# EAGLE design X15_Brickstribution (EAGLE 9.6.2)

## Sheet 1 of 2
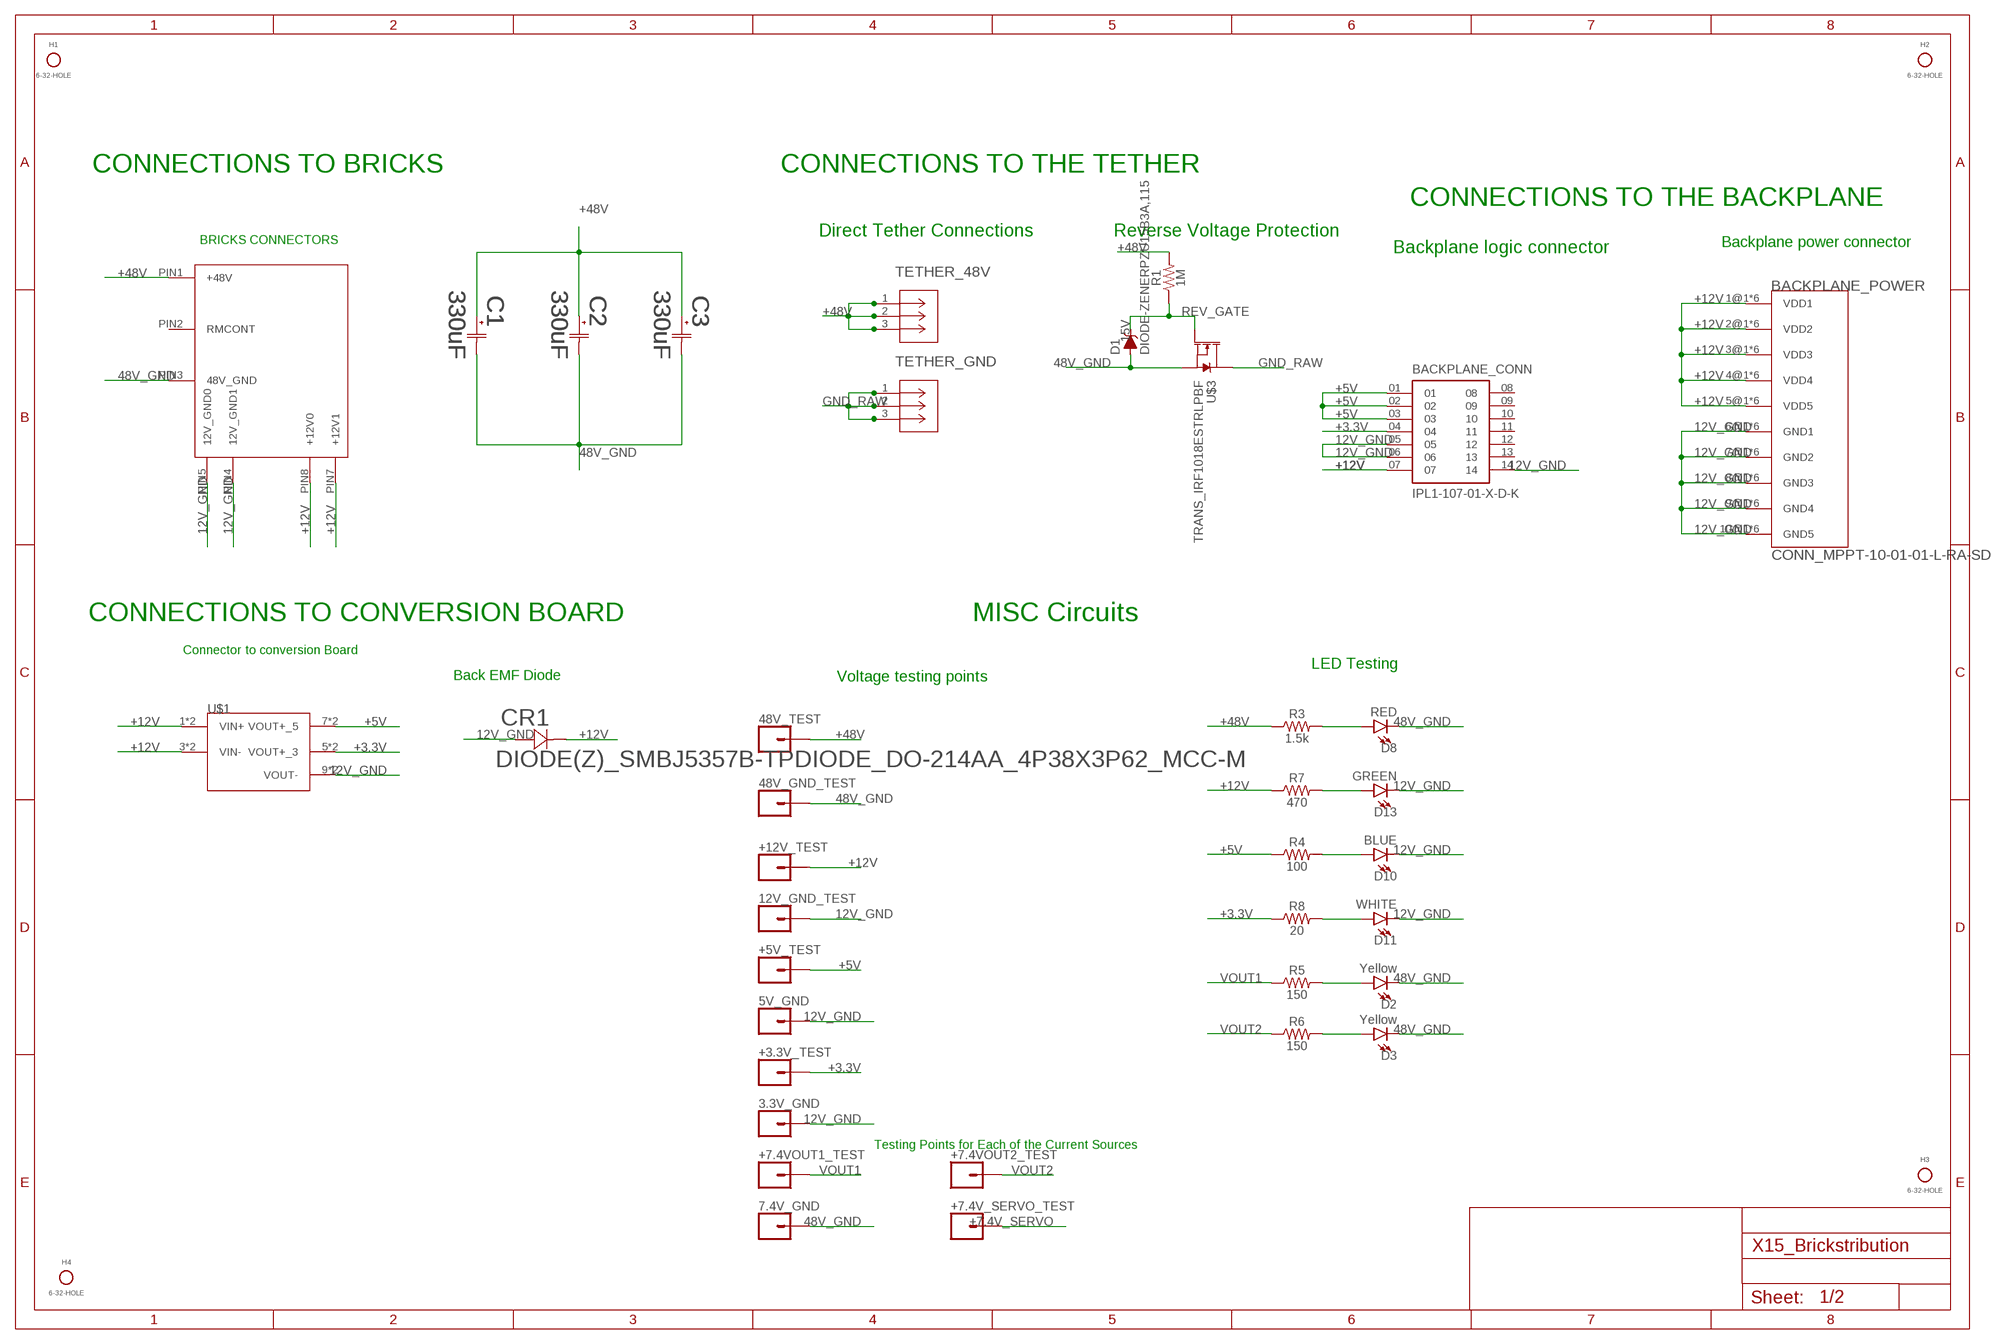
[diagram p0: schematic, sheet 1]

### Parts
3.3V_GND  CONN_01  [1X01]
5V_GND  CONN_01  [1X01]
7.4V_GND  CONN_01  [1X01]
12V_GND_TEST  CONN_01  [1X01]
48V_GND_TEST  CONN_01  [1X01]
48V_TEST  CONN_01  [1X01]
+3.3V_TEST  CONN_01  [1X01]
+5V_TEST  CONN_01  [1X01]
+7.4V_SERVO_TEST  CONN_01  [1X01]
+7.4VOUT1_TEST  CONN_01  [1X01]
+7.4VOUT2_TEST  CONN_01  [1X01]
+12V_TEST  CONN_01  [1X01]
BACKPLANE_CONN  IPL1-107-01-X-D-K  [SAMTEC_IPL1-107-01-X-D-K]
BACKPLANE_POWER  CONN_MPPT-10-01-01-L-RA-SD  [MPPT-10-01-01-L-RA-SD]
C1  330uF  CAP_MAL215099112E3CAP_099112E3_VIS-M  [CAP_099112E3_VIS-M]
C2  330uF  CAP_MAL215099112E3CAP_099112E3_VIS-M  [CAP_099112E3_VIS-M]
C3  330uF  CAP_MAL215099112E3CAP_099112E3_VIS-M  [CAP_099112E3_VIS-M]
CR1  DIODE(Z)_SMBJ5357B-TPDIODE_DO-214AA_4P38X3P62_MCC-M  [DIODE_DO-214AA_4P38X3P62_MCC-M]
D1  DIODE-ZENERPZU15B3A,115  [SOD-323]
D2  Yellow  LED-YELLOW0603  [LED-0603]
D3  Yellow  LED-YELLOW0603  [LED-0603]
D8  RED  LED-RED0603  [LED-0603]
D10  BLUE  LED-BLUE0603  [LED-0603]
D11  WHITE  LED-WHITE0603  [LED-0603]
D13  GREEN  LED-GREEN0603  [LED-0603]
H1  6-32-HOLE  [6-32-HOLE]
H2  6-32-HOLE  [6-32-HOLE]
H3  6-32-HOLE  [6-32-HOLE]
H4  6-32-HOLE  [6-32-HOLE]
R1  1M  1MOHM-0603-1/4W-5%  [0603]
R3  1.5k  1.5KOHM-0603-1/10W-1%  [0603]
R4  100  100OHM-0603-1/4W-5%  [0603]
R5  150  150OHM-0603-1/10W-1%  [0603]
R6  150  150OHM-0603-1/10W-1%  [0603]
R7  470  470OHM-0603-1/10W-1%  [0603]
R8  20  20OHM-0603-1/10W-1%  [0603]
TETHER_48V  796636-3(TETHER)  [CON3_P5MM_VER_TERM-BLK_TYC]
TETHER_GND  796636-3(TETHER)  [CON3_P5MM_VER_TERM-BLK_TYC]
U$1  CONN_DISTRIBUTION_TO_CONVERSION  [TSW-105-05-G-S(D-C)]
U$2  CONN_BMR480_CONNECTOR  [BMR480_CONNECTOR]
U$3  TRANS_IRF1018ESTRLPBF  TRANS_IRF1018EPBF  [D2PAK]

### Nets
12V_GND: 3.3V_GND.1 5V_GND.1 12V_GND_TEST.1 BACKPLANE_CONN.05 BACKPLANE_CONN.06 BACKPLANE_CONN.14 BACKPLANE_POWER.6@1(GND1) BACKPLANE_POWER.6@2(GND1) BACKPLANE_POWER.6@3(GND1) BACKPLANE_POWER.6@4(GND1) BACKPLANE_POWER.6@5(GND1) BACKPLANE_POWER.6@6(GND1) BACKPLANE_POWER.7@1(GND2) BACKPLANE_POWER.7@2(GND2) BACKPLANE_POWER.7@3(GND2) BACKPLANE_POWER.7@4(GND2) BACKPLANE_POWER.7@5(GND2) BACKPLANE_POWER.7@6(GND2) BACKPLANE_POWER.8@1(GND3) BACKPLANE_POWER.8@2(GND3) BACKPLANE_POWER.8@3(GND3) BACKPLANE_POWER.8@4(GND3) BACKPLANE_POWER.8@5(GND3) BACKPLANE_POWER.8@6(GND3) BACKPLANE_POWER.9@1(GND4) BACKPLANE_POWER.9@2(GND4) BACKPLANE_POWER.9@3(GND4) BACKPLANE_POWER.9@4(GND4) BACKPLANE_POWER.9@5(GND4) BACKPLANE_POWER.9@6(GND4) BACKPLANE_POWER.10@1(GND5) BACKPLANE_POWER.10@2(GND5) BACKPLANE_POWER.10@3(GND5) BACKPLANE_POWER.10@4(GND5) BACKPLANE_POWER.10@5(GND5) BACKPLANE_POWER.10@6(GND5) CR1.2 D10.C D11.C D13.C U$1.9(VOUT-) U$1.10(VOUT-) U$2.PIN4(12V_GND1) U$2.PIN5(12V_GND0)
48V_GND: 7.4V_GND.1 48V_GND_TEST.1 C1.2 C2.2 C3.2 D1.A D2.C D3.C D8.C U$2.PIN3(48V_GND) U$3.2(S) ; also sheet 2
+3.3V: +3.3V_TEST.1 BACKPLANE_CONN.04 R8.1 U$1.5(VOUT+_3) U$1.6(VOUT+_3)
+5V: +5V_TEST.1 BACKPLANE_CONN.01 BACKPLANE_CONN.02 BACKPLANE_CONN.03 R4.1 U$1.7(VOUT+_5) U$1.8(VOUT+_5)
+7.4V_SERVO: +7.4V_SERVO_TEST.1 ; also sheet 2
+12V: +12V_TEST.1 BACKPLANE_CONN.07 BACKPLANE_POWER.1@1(VDD1) BACKPLANE_POWER.1@2(VDD1) BACKPLANE_POWER.1@3(VDD1) BACKPLANE_POWER.1@4(VDD1) BACKPLANE_POWER.1@5(VDD1) BACKPLANE_POWER.1@6(VDD1) BACKPLANE_POWER.2@1(VDD2) BACKPLANE_POWER.2@2(VDD2) BACKPLANE_POWER.2@3(VDD2) BACKPLANE_POWER.2@4(VDD2) BACKPLANE_POWER.2@5(VDD2) BACKPLANE_POWER.2@6(VDD2) BACKPLANE_POWER.3@1(VDD3) BACKPLANE_POWER.3@2(VDD3) BACKPLANE_POWER.3@3(VDD3) BACKPLANE_POWER.3@4(VDD3) BACKPLANE_POWER.3@5(VDD3) BACKPLANE_POWER.3@6(VDD3) BACKPLANE_POWER.4@1(VDD4) BACKPLANE_POWER.4@2(VDD4) BACKPLANE_POWER.4@3(VDD4) BACKPLANE_POWER.4@4(VDD4) BACKPLANE_POWER.4@5(VDD4) BACKPLANE_POWER.4@6(VDD4) BACKPLANE_POWER.5@1(VDD5) BACKPLANE_POWER.5@2(VDD5) BACKPLANE_POWER.5@3(VDD5) BACKPLANE_POWER.5@4(VDD5) BACKPLANE_POWER.5@5(VDD5) BACKPLANE_POWER.5@6(VDD5) CR1.1 R7.1 U$1.1(VIN+) U$1.2(VIN+) U$1.3(VIN-) U$1.4(VIN-) U$2.PIN7(+12V1) U$2.PIN8(+12V0)
+48V: 48V_TEST.1 C1.1 C2.1 C3.1 R1.2 R3.1 TETHER_48V.1 TETHER_48V.2 TETHER_48V.3 U$2.PIN1(+48V) ; also sheet 2
GND_RAW: TETHER_GND.1 TETHER_GND.2 TETHER_GND.3 U$3.3(D)
N$4: D8.A R3.2
N$9: D10.A R4.2
N$10: D11.A R8.2
N$11: D3.A R6.2
N$12: D2.A R5.2
N$13: D13.A R7.2
REV_GATE: D1.C R1.1 U$3.1(G)
VOUT1: +7.4VOUT1_TEST.1 R5.1 ; also sheet 2
VOUT2: +7.4VOUT2_TEST.1 R6.1 ; also sheet 2
Unconnected: BACKPLANE_CONN.08 BACKPLANE_CONN.09 BACKPLANE_CONN.10 BACKPLANE_CONN.11 BACKPLANE_CONN.12 BACKPLANE_CONN.13 U$2.PIN2(RMCONT)

### Notes on the sheet
- CONNECTIONS TO BRICKS | CONNECTIONS TO THE TETHER
- CONNECTIONS TO THE BACKPLANE
- Direct Tether Connections | Reverse Voltage Protection
- BRICKS CONNECTORS | Backplane power connector
- Backplane logic connector
- CONNECTIONS TO CONVERSION BOARD | MISC Circuits
- Connector to conversion Board
- LED Testing
- Back EMF Diode | Voltage testing points
- Testing Points for Each of the Current Sources

## Sheet 2 of 2
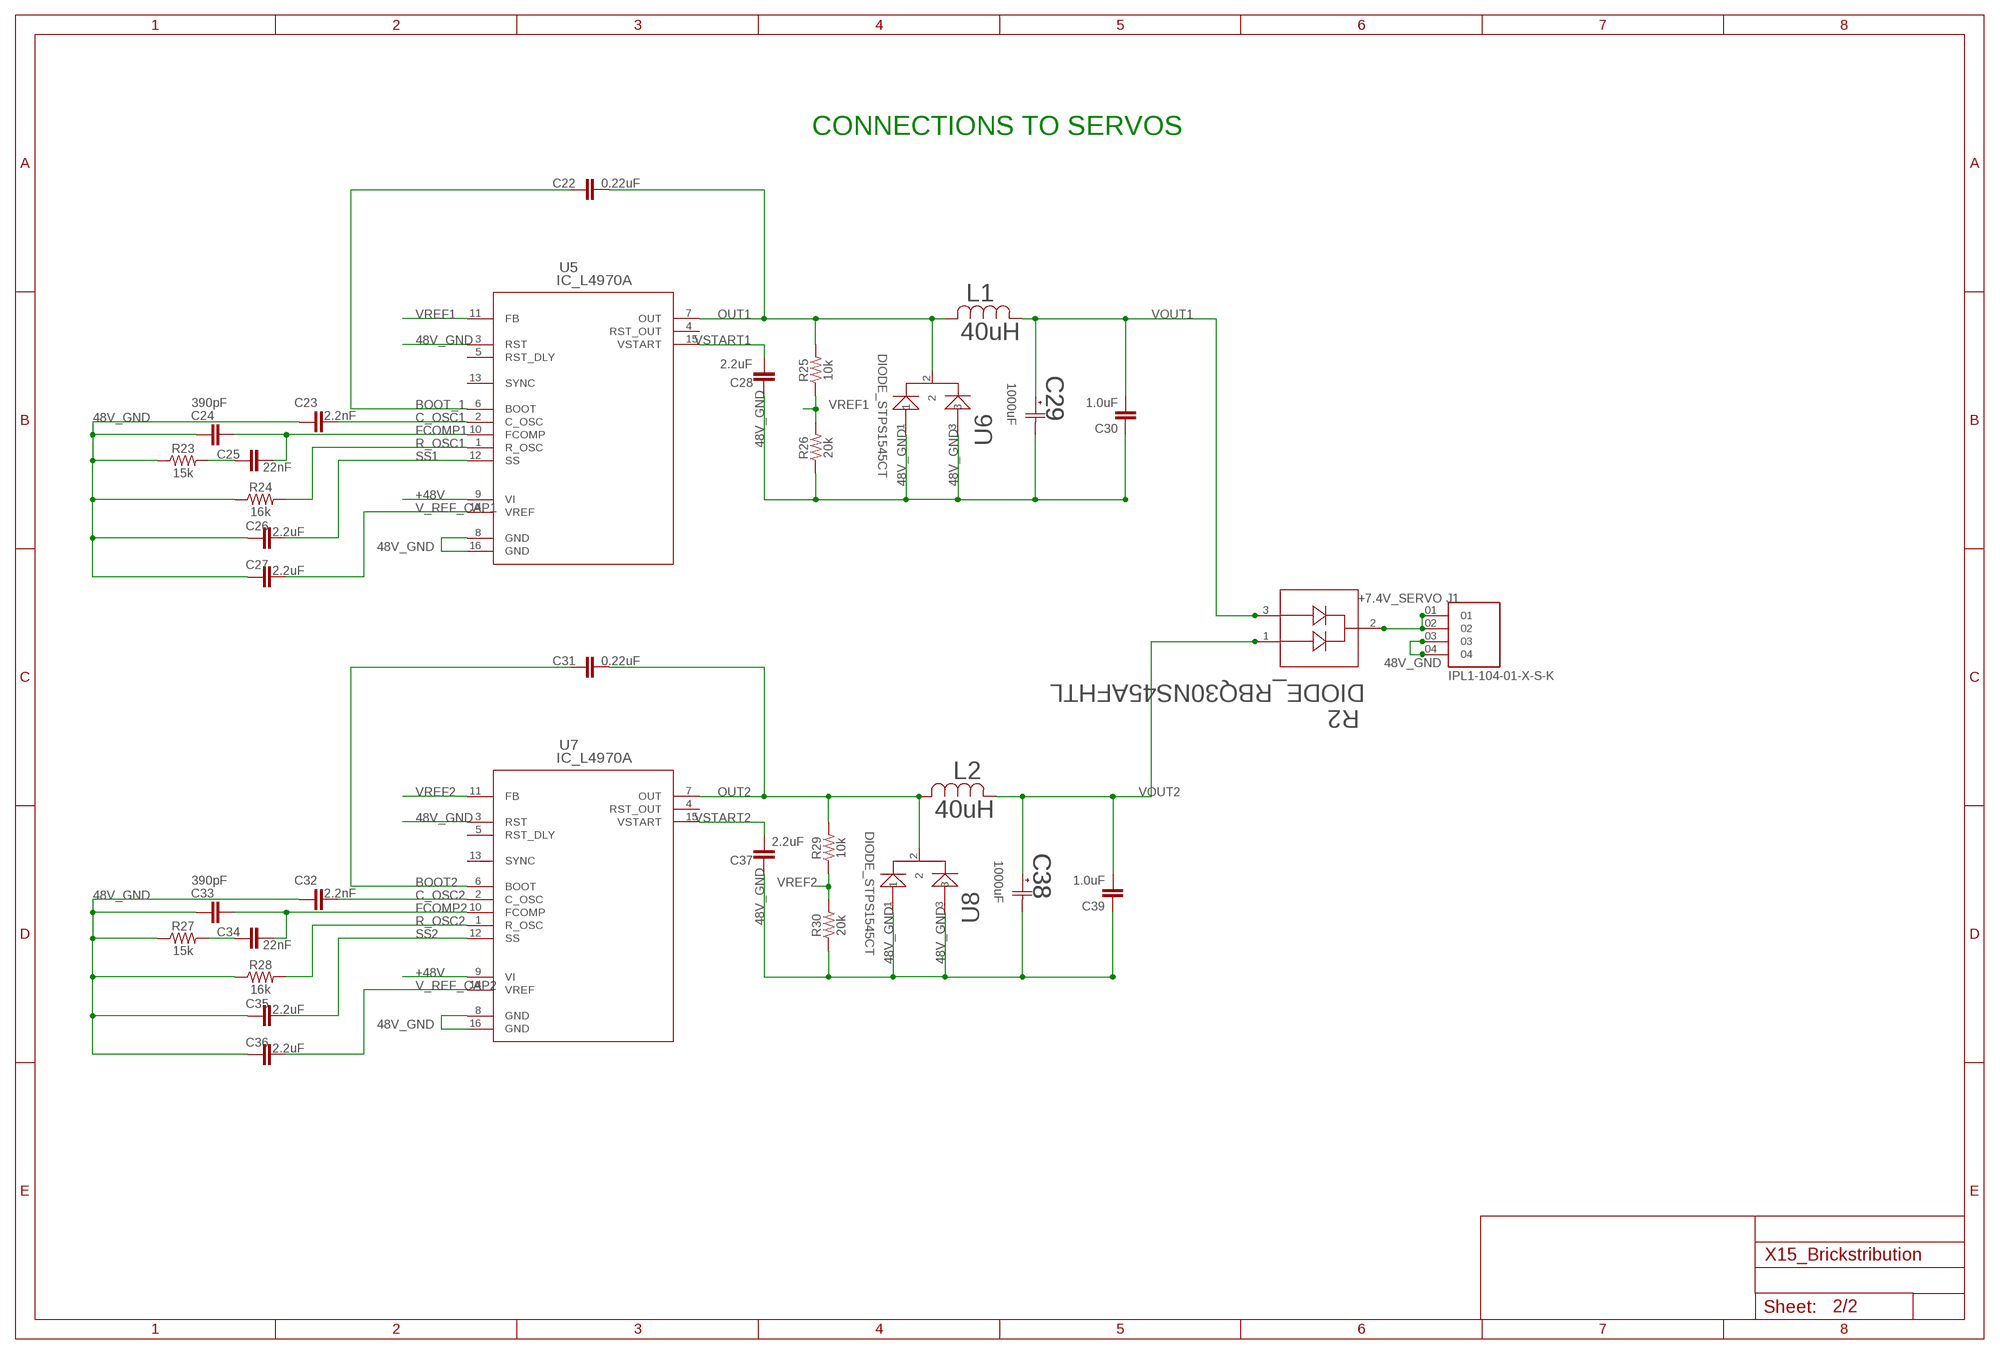
[diagram p1: schematic, sheet 2]

### Parts
C22  0.22uF  0.22UF-0603-25V-10%  [0603]
C23  2.2nF  2.2NF/2200PF-0603-50V-10%  [0603]
C24  390pF  390NF-0603-10V-10%  [0603]
C25  22nF  22NF/22,000PF-0603-50V-10%  [0603]
C26  2.2uF  2.2UF-0603-10V-20%  [0603]
C27  2.2uF  2.2UF-0603-10V-20%  [0603]
C28  2.2uF  2.2UF-0603-10V-20%  [0603]
C29  1000uF  CAP_PCG1A102MCL1GSCAP_PC_10X12P7_NCH-M  [CAP_PC_10X12P7_NCH-M]
C30  1.0uF  1.0UF-0603-16V-10%  [0603]
C31  0.22uF  0.22UF-0603-25V-10%  [0603]
C32  2.2nF  2.2NF/2200PF-0603-50V-10%  [0603]
C33  390pF  390NF-0603-10V-10%  [0603]
C34  22nF  22NF/22,000PF-0603-50V-10%  [0603]
C35  2.2uF  2.2UF-0603-10V-20%  [0603]
C36  2.2uF  2.2UF-0603-10V-20%  [0603]
C37  2.2uF  2.2UF-0603-10V-20%  [0603]
C38  1000uF  CAP_PCG1A102MCL1GSCAP_PC_10X12P7_NCH-M  [CAP_PC_10X12P7_NCH-M]
C39  1.0uF  1.0UF-0603-16V-10%  [0603]
J1  IPL1-104-01-X-S-K  [SAMTEC_IPL1-104-01-X-S-K]
L1  40uH  IND_2308-V-RC  [IND_23XX-V_53_53]
L2  40uH  IND_2308-V-RC  [IND_23XX-V_53_53]
R2  DIODE_RBQ30NS45AFHTL  [TRANS_R5009FNJ_ROM]
R23  15k  15KOHM-0603-1/10W-1%  [0603]
R24  16k  16.2KOHM-0603-1/10W-1%  [0603]
R25  10k  10KOHM-0603-1/10W-1%  [0603]
R26  20k  20KOHM-0603-1/10W-1%  [0603]
R27  15k  15KOHM-0603-1/10W-1%  [0603]
R28  16k  16.2KOHM-0603-1/10W-1%  [0603]
R29  10k  10KOHM-0603-1/10W-1%  [0603]
R30  20k  20KOHM-0603-1/10W-1%  [0603]
U5  IC_L4970A  [MULTIWATT15_V_STM]
U6  DIODE_STPS1545CT  [TO-220AB_STM]
U7  IC_L4970A  [MULTIWATT15_V_STM]
U8  DIODE_STPS1545CT  [TO-220AB_STM]

### Nets
48V_GND: C23.1 C24.1 C26.1 C27.1 C28.1 C29.2 C30.1 C32.1 C33.1 C35.1 C36.1 C37.1 C38.2 C39.1 J1.03 J1.04 R23.1 R24.1 R26.1 R27.1 R28.1 R30.1 U5.3(RST) U5.8(GND) U5.16(GND) U6.1 U6.3 U7.3(RST) U7.8(GND) U7.16(GND) U8.1 U8.3 ; also sheet 1
+7.4V_SERVO: J1.01 J1.02 R2.2 ; also sheet 1
+48V: U5.9(VI) U7.9(VI) ; also sheet 1
BOOT2: C31.1 U7.6(BOOT)
BOOT_1: C22.1 U5.6(BOOT)
C_OSC1: C23.2 U5.2(C_OSC)
C_OSC2: C32.2 U7.2(C_OSC)
FCOMP1: C24.2 C25.2 U5.10(FCOMP)
FCOMP2: C33.2 C34.2 U7.10(FCOMP)
N$14: C25.1 R23.2
N$15: C34.1 R27.2
OUT1: C22.2 L1.2 R25.2 U5.7(OUT) U6.2
OUT2: C31.2 L2.2 R29.2 U7.7(OUT) U8.2
R_OSC1: R24.2 U5.1(R_OSC)
R_OSC2: R28.2 U7.1(R_OSC)
SS1: C26.2 U5.12(SS)
SS2: C35.2 U7.12(SS)
V_REF_CAP1: C27.2 U5.14(VREF)
V_REF_CAP2: C36.2 U7.14(VREF)
VOUT1: C29.1 C30.2 L1.1 R2.3 ; also sheet 1
VOUT2: C38.1 C39.2 L2.1 R2.1 ; also sheet 1
VREF1: R25.1 R26.2 U5.11(FB)
VREF2: R29.1 R30.2 U7.11(FB)
VSTART1: C28.2 U5.15(VSTART)
VSTART2: C37.2 U7.15(VSTART)
Unconnected: U5.4(RST_OUT) U5.5(RST_DLY) U5.13(SYNC) U7.4(RST_OUT) U7.5(RST_DLY) U7.13(SYNC)

### Notes on the sheet
- CONNECTIONS TO SERVOS

## Library data of the parts
3.3V_GND 5V_GND 7.4V_GND 12V_GND_TEST 48V_GND_TEST 48V_TEST +3.3V_TEST +5V_TEST +7.4V_SERVO_TEST +7.4VOUT1_TEST +7.4VOUT2_TEST +12V_TEST = SparkFun-Connectors:CONN_01: Single connection point. Often used as Generic Header-pin footprint for 0.1 inch spaced/style header connections On any of the 0.1 inch spaced packages, you can populate with these: Break Away Headers - Straight <https://www.sparkfun.com/products/116> (PRT-00116) Break Away Male Headers - Right Angle <https://www.sparkfun.com/products/553> (PRT-00553) Female Headers <https://www.sparkfun.com/products/115> (PRT-00115) Break Away Headers - Machine Pin <https://www.sparkfun.com/products/117> (PRT-00117) Break Away Female Headers - Swiss Machine Pin <https://www.sparkfun.com/products/743> (PRT-00743) This device is also useful as a general connection point to wire up your design to another part of your project. Our various solder wires solder well into these plated through hole pads. Hook-Up Wire - Assortment (Stranded, 22 AWG) <https://www.sparkfun.com/products/11375> (PRT-11375) Hook-Up Wire - Assortment (Solid Core, 22 AWG) <https://www.sparkfun.com/products/11367> (PRT-11367) View the entire wire category on our website here <https://www.sparkfun.com/categories/141> Special notes: SMTSO-256-ET is a "flush mount" nut for a 4-40 screw. We mostly use this on specialty testbeds; it is a nice way to connect hardware to your PCB at an adjustable hieght. Also note, the SNAP packages are for using a snappable style connector. We sell a baggie of snaps and they are also used on two LilyPad designs: Snap Assortment - 30 pack (male and female) <https://www.sparkfun.com/products/11347> (DEV-11347) LilyPad Arduino SimpleSnap <https://www.sparkfun.com/products/10941> (DEV-10941) LilyPad SimpleSnap Protoboard <https://www.sparkfun.com/products/10940> (DEV-10940)
BACKPLANE_CONN = X15_Brickstribution:IPL1-107-01-X-D-K
BACKPLANE_POWER = X15_Brickstribution:CONN_MPPT-10-01-01-L-RA-SD
C1-C3 = X15_Brickstribution:CAP_MAL215099112E3; COPYRIGHT: Copyright (C) 2022 Ultra Librarian. All rights reserved.; MANUFACTURER_PART_NUMBER: MAL215099112E3; MFR_NAME: Vishay
C22 C31 = SparkFun-Capacitors:0.22UF: 0.22µF ceramic capacitors A capacitor is a passive two-terminal electrical component used to store electrical energy temporarily in an electric field.; PROD_ID: CAP-07822
C23 C32 = SparkFun-Capacitors:2.2NF/2200PF: 2.2nF/2,200pF ceramic capacitors A capacitor is a passive two-terminal electrical component used to store electrical energy temporarily in an electric field.; PROD_ID: CAP-07877
C24 C33 = SparkFun-Capacitors:390NF: 0.39uF/390nF ceramic capacitors A capacitor is a passive two-terminal electrical component used to store electrical energy temporarily in an electric field.; PROD_ID: CAP-10986; VALUE: 390nF
C25 C34 = SparkFun-Capacitors:22NF/22,000PF: 0.022uF/22nF/22,000pF ceramic capacitors A capacitor is a passive two-terminal electrical component used to store electrical energy temporarily in an electric field.; PROD_ID: CAP-07885
C26-C28 C35-C37 = SparkFun-Capacitors:2.2UF: 2.2µF ceramic capacitors A capacitor is a passive two-terminal electrical component used to store electrical energy temporarily in an electric field.; PROD_ID: CAP-07888
C29 C38 = X15_Brickstribution:CAP_PCG1A102MCL1GS; COPYRIGHT: Copyright (C) 2022 Ultra Librarian. All rights reserved.; DIGI-KEY_PART_NUMBER_1: 493-3094-1-ND; DIGI-KEY_PART_NUMBER_2: 493-3094-2-ND; DIGI-KEY_PART_NUMBER_3: 493-3094-6-ND; MANUFACTURER_PART_NUMBER: PCG1A102MCL1GS; MFR_NAME: Nichicon
C30 C39 = SparkFun-Capacitors:1.0UF: 1µF ceramic capacitors A capacitor is a passive two-terminal electrical component used to store electrical energy temporarily in an electric field.; PROD_ID: CAP-00868
CR1 = X15_Brickstribution:DIODE(Z)_SMBJ5357B-TP; COPYRIGHT: Copyright (C) 2022 Ultra Librarian. All rights reserved.; MANUFACTURER_PART_NUMBER: SMBJ5357B-TP; MFR_NAME: MCC
D1 = SparkFun-DiscreteSemi:DIODE-ZENER: Zener Diode A Zener diode allows current to flow from its anode to its cathode like a normal semiconductor diode, but it also permits current to flow in the reverse direction when its "Zener voltage" is reached. - WIkipedia; ZENER_VOLTAGE: 15V
D2 D3 = SparkFun-LED:LED-YELLOW: Yellow SMD LED Used in manufacturing several products at SparkFun. Packages: 0603 - SMD 0603 package[Product Link] <http://www.kingbrightusa.com/product.asp?catalog_name=LED&product_id=APT1608SYCK> 0603 -SMART - SMART SMD 0603 package (more efficient/more expensive) [Product Link] <http://www.osram-os.com/osram_os/en/products/product-catalog/led-light-emitting-diodes/smartled-0603/ly-l29k/index.jsp> LilyPad - SMD1206 package[Product Datasheet] <https://www.sparkfun.com/datasheets/DevTools/LilyPad/Q150YUS4.pdf> SparkFun Products: Blynk Board <https://www.sparkfun.com/products/13794> IOIO-OTG <https://www.sparkfun.com/products/13613> XBee Explorer Serial <https://www.sparkfun.com/products/13225>; PROD_ID: DIO-09003
D8 = SparkFun-LED:LED-RED: Red SMD LED Used in manufacturing of most products at SparkFun Packages: 0603 - SMD 0603 package [Product Link] <http://docs.avagotech.com/docs/AV02-0551EN> 0603 SMART - SMD 0603 SMART package ( more efficient and expensive)[Product Link] <http://www.osram-os.com/Graphics/XPic2/00077099_0.pdf> 1206 - SMD1206 package [Product Link] <https://www.sparkfun.com/datasheets/DevTools/LilyPad/Q150OVS4.pdff> SparkFun Products: Pro Mini 328 -5V <https://www.sparkfun.com/products/821> RedBoard <https://www.sparkfun.com/products/12757> IOIO-OTG <https://www.sparkfun.com/products/13613>; PROD_ID: DIO-00819
D10 = SparkFun-LED:LED-BLUE: Blue SMD LED Used in manufacturing of various products at SparkFun Packages: 0603 - SMD 0603 package [Product Link] <http://www.digikey.com/product-detail/en/SMLE12BC7TT86/511-1589-2-ND/1641808> 1206 - SMD1206 package [Product Link] <http://www.digikey.com/product-detail/en/lite-on-inc/LTST-C150TBKT/160-1643-1-ND/573584> SparkFun Products: ESP8266 Thing-Dev Board <https://www.sparkfun.com/products/13711> RedBoard <https://www.sparkfun.com/products/12757>; PROD_ID: DIO-08575
D11 = SparkFun-LED:LED-WHITE: White SMD LED Used in manufacturing several products at SparkFun. Packages: 0603 - Bright White SMD 0603 package[Product Link] <http://www.kingbrightusa.com/product.asp?catalog_name=LED&product_id=APT1608QWF/D> 1206 - Bright White SMD1206 package [Product Link] <http://www.kingbrightusa.com/product.asp?catalog_name=LED&product_id=APT3216QWF/D> 3014 - Super Bright SMD 3014 package [Datasheet] <http://www.lumileds.com/uploads/459/DS208-pdf> SparkFun Products: Blackberry Trackballer Breakout <https://www.sparkfun.com/products/13169> Digital SandBox <https://www.sparkfun.com/products/12651>; PROD_ID: DIO-09004
D13 = SparkFun-LED:LED-GREEN: Green SMD LED Used in manufacturing of various products at SparkFun Packages: 0603 - SMD 0603 package [Product Link] <http://www.futureelectronics.com/en/technologies/semiconductors/optoelectronics/leds/Pages/9894312-LTST-C190GKT.aspx?CrossPart=HSMG-C190&IM=0> LilyPad 1206 - SMD1206 LilyPad package [Product Link] <http://www.futureelectronics.com/en/Technologies/Product.aspx?ProductID=IN150NGHARVATEKCORPORATION2049943&IM=0> 1206 - SMD1206 package [Product Link] <http://www.futureelectronics.com/en/technologies/semiconductors/optoelectronics/leds/Pages/8315665-LTST-C150KGKT.aspx?IM=0> 1206 Bottom Mount -SMD 1206 Bottom Mount [Product Link] <http://www.digikey.com/product-detail/en/lite-on-inc/LTST-C230KGKT/160-1456-1-ND/386854> SparkFun Products: Pro Mini 328 -5V <https://www.sparkfun.com/products/821> RedBoard <https://www.sparkfun.com/products/12757> MP3 Trigger <https://www.sparkfun.com/products/13720> Makey Makey <https://www.sparkfun.com/products/11076>; PROD_ID: DIO-00821
H1-H4 = X15_Brickstribution:6-32-HOLE
J1 = X15_Brickstribution:IPL1-104-01-X-S-K; MANUFACTURER: SAMTEC; PARTREV: E
L1 L2 = X15_Brickstribution:IND_2308-V-RC; COPYRIGHT: Copyright (C) 2022 Ultra Librarian. All rights reserved.; MANUFACTURER_PART_NUMBER: 2308-V-RC; MFR_NAME: Bourns Electronics
R1 = SparkFun-Resistors:1MOHM: 1MΩ resistor A resistor is a passive two-terminal electrical component that implements electrical resistance as a circuit element. Resistors act to reduce current flow, and, at the same time, act to lower voltage levels within circuits. - Wikipedia; PROD_ID: RES-07868
R2 = X15_Brickstribution:DIODE_RBQ30NS45AFHTL; COPYRIGHT: Copyright (C) 2022 Ultra Librarian. All rights reserved.; MANUFACTURER_PART_NUMBER: RBQ30NS45AFHTL; MFR_NAME: ROHM Semiconductor
R3 = SparkFun-Resistors:1.5KOHM: 1.5kΩ resistor A resistor is a passive two-terminal electrical component that implements electrical resistance as a circuit element. Resistors act to reduce current flow, and, at the same time, act to lower voltage levels within circuits. - Wikipedia; PROD_ID: RES-08306
R4 = SparkFun-Resistors:100OHM: 100Ω resistor A resistor is a passive two-terminal electrical component that implements electrical resistance as a circuit element. Resistors act to reduce current flow, and, at the same time, act to lower voltage levels within circuits. - Wikipedia; PROD_ID: RES-12438
R5 R6 = SparkFun-Resistors:150OHM: 150Ω resistor A resistor is a passive two-terminal electrical component that implements electrical resistance as a circuit element. Resistors act to reduce current flow, and, at the same time, act to lower voltage levels within circuits. - Wikipedia; PROD_ID: RES-11028
R7 = SparkFun-Resistors:470OHM: 470Ω resistor A resistor is a passive two-terminal electrical component that implements electrical resistance as a circuit element. Resistors act to reduce current flow, and, at the same time, act to lower voltage levels within circuits. - Wikipedia; PROD_ID: RES-07869
R8 = SparkFun-Resistors:20OHM: RES-07862; PROD_ID: RES-07862
R23 R27 = SparkFun-Resistors:15KOHM: 15kΩ resistor A resistor is a passive two-terminal electrical component that implements electrical resistance as a circuit element. Resistors act to reduce current flow, and, at the same time, act to lower voltage levels within circuits. - Wikipedia; PROD_ID: RES-07854
R24 R28 = SparkFun-Resistors:16.2KOHM: 16.2kΩ resistor A resistor is a passive two-terminal electrical component that implements electrical resistance as a circuit element. Resistors act to reduce current flow, and, at the same time, act to lower voltage levels within circuits. - Wikipedia; PROD_ID: RES-12187; VALUE: 16.2k
R25 R29 = SparkFun-Resistors:10KOHM: 10kΩ resistor A resistor is a passive two-terminal electrical component that implements electrical resistance as a circuit element. Resistors act to reduce current flow, and, at the same time, act to lower voltage levels within circuits. - Wikipedia; PROD_ID: RES-00824
R26 R30 = SparkFun-Resistors:20KOHM: 20kΩ resistor A resistor is a passive two-terminal electrical component that implements electrical resistance as a circuit element. Resistors act to reduce current flow, and, at the same time, act to lower voltage levels within circuits. - Wikipedia; PROD_ID: RES-09383
TETHER_48V TETHER_GND = X15_Brickstribution:796636-3(TETHER); COPYRIGHT: Copyright (C) 2022 Ultra Librarian. All rights reserved.; DIGI-KEY_PART_NUMBER_1: A98423-ND; MANUFACTURER_PART_NUMBER: 796636-3; MFR_NAME: TE Connectivity
U5 U7 = X15_Brickstribution:IC_L4970A; COPYRIGHT: Copyright (C) 2022 Ultra Librarian. All rights reserved.; MANUFACTURER_PART_NUMBER: L4970A; MFR_NAME: STMicroelectronics
U6 U8 = X15_Brickstribution:DIODE_STPS1545CT; COPYRIGHT: Copyright (C) 2022 Ultra Librarian. All rights reserved.; MANUFACTURER_PART_NUMBER: STPS1545CT; MFR_NAME: STMicroelectronics
U$1 = X15_Brickstribution:CONN_DISTRIBUTION_TO_CONVERSION
U$2 = X15_Brickstribution:CONN_BMR480_CONNECTOR
U$3 = X15_Brickstribution:TRANS_IRF1018EPBF

## Board
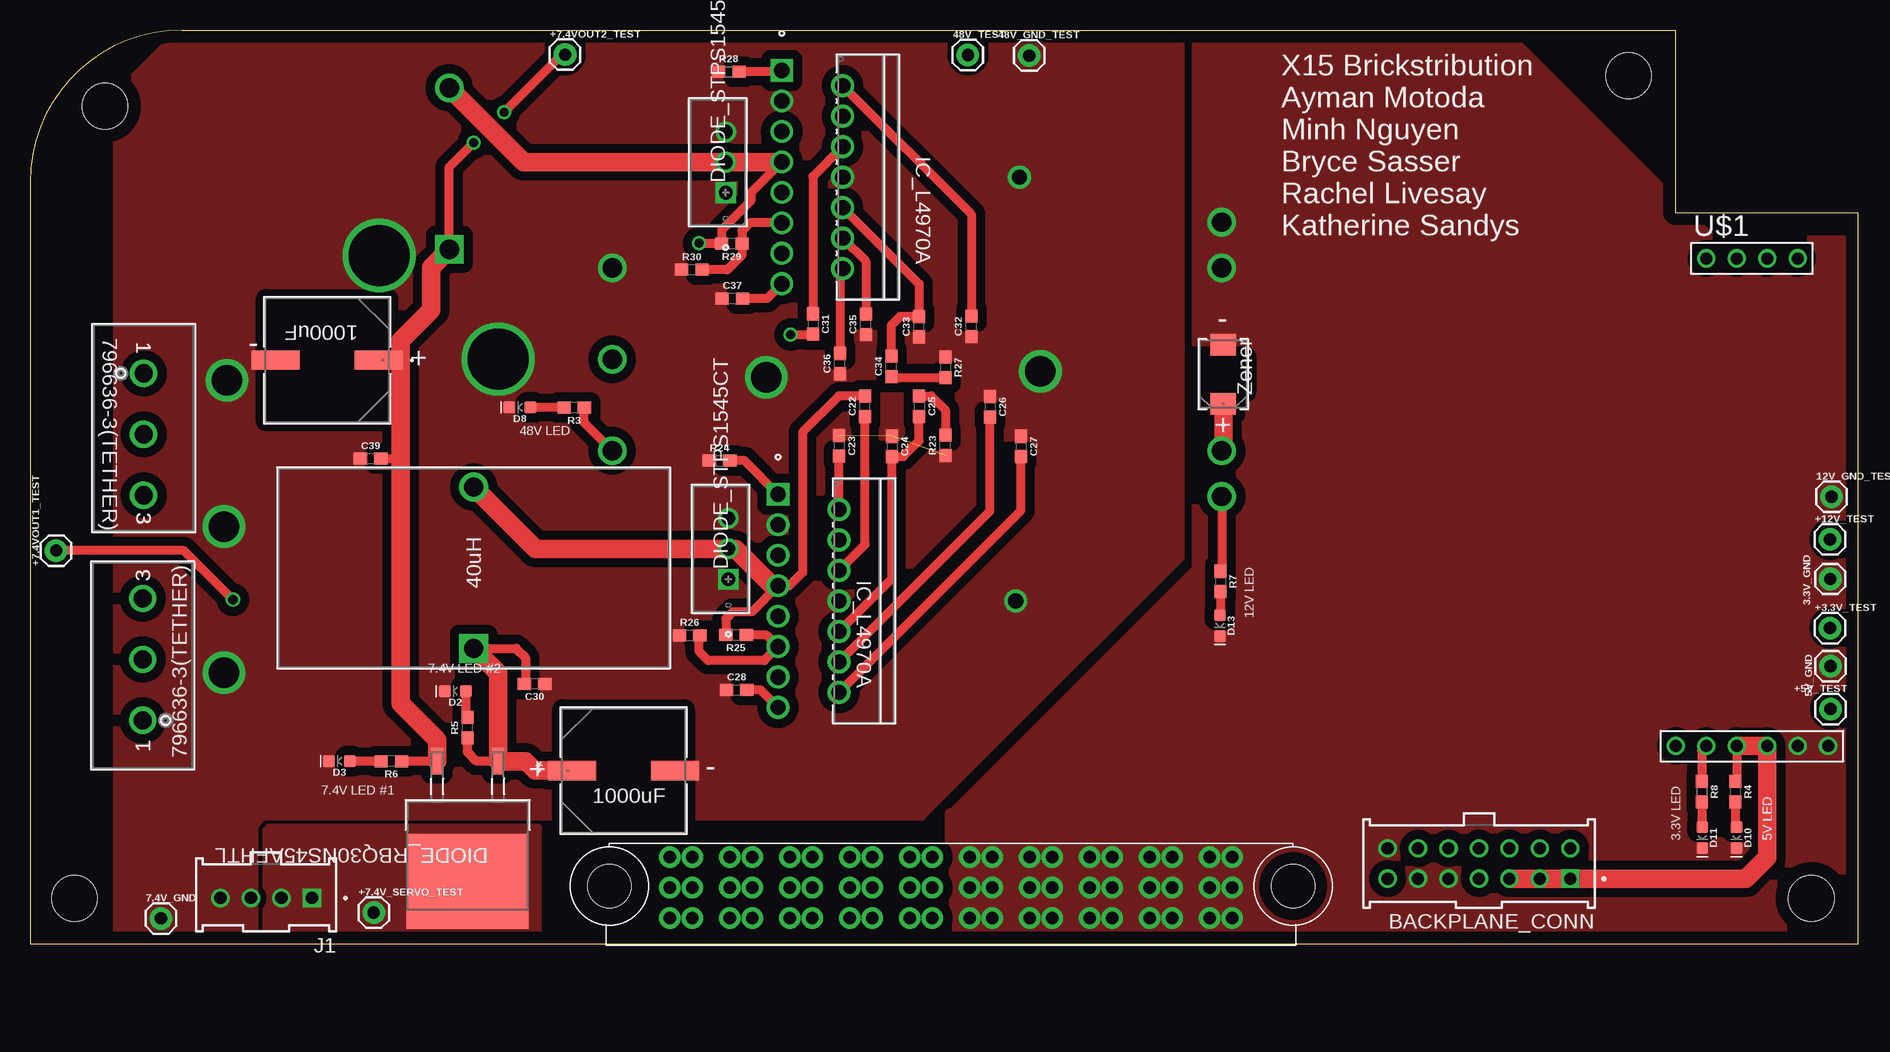
[diagram p2: board, top side]
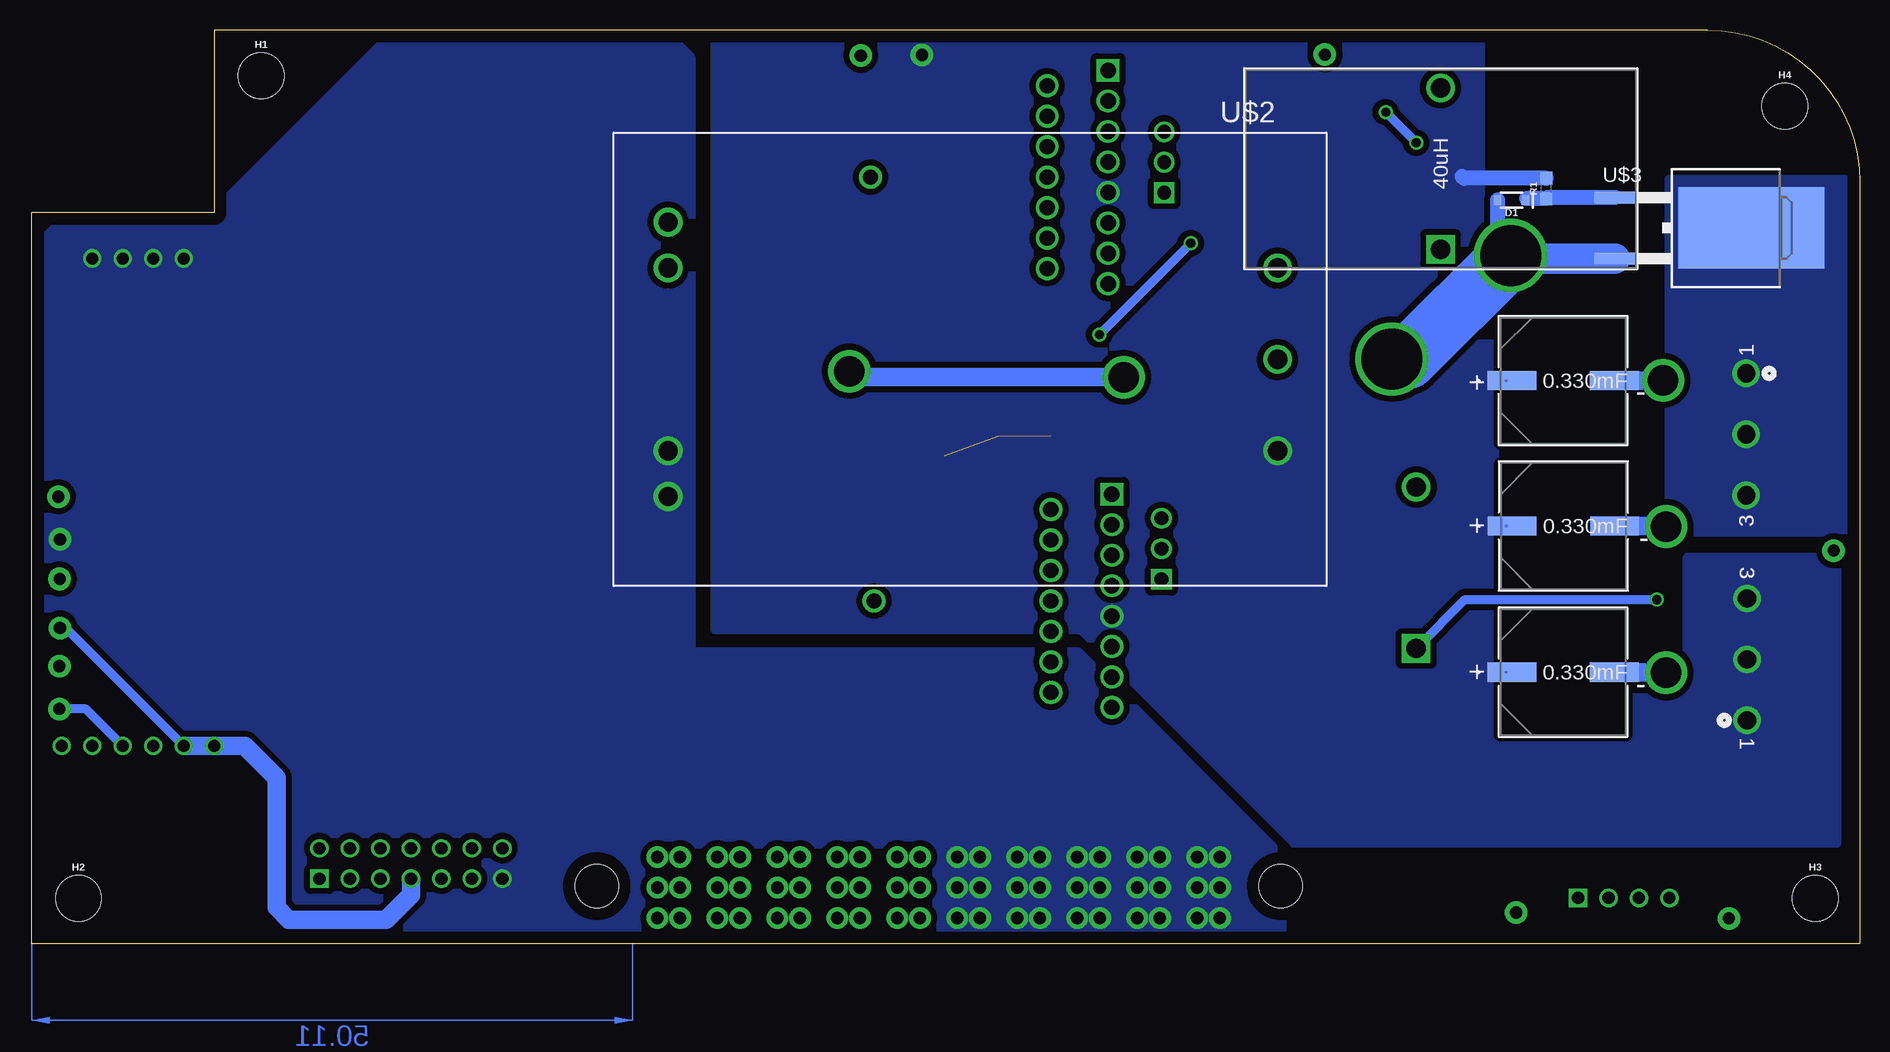
[diagram p3: board, bottom side, seen from below]

Size 152.4 x 76.2 mm. Coordinates in mm from the lower left corner, seen from the top.
Outline: 0,0 152.4,0 152.4,60.96 137.16,60.96 137.16,76.2 12.7,76.2 arc90 0,63.5 0,0
Copper layers (1*16): Top 0.035mm / dielectric 1.5mm / Bottom 0.035mm
Design rules "477": minimum track width 6mil, minimum drill 0.35mm, track to track 6mil, track to pad 6mil, pad to pad 6mil, via to via 6mil, smd to smd 6mil, copper to edge 40mil, drill to drill 6mil, minimum pad ring 10mil, minimum via ring 8mil, stop-mask expansion 4mil, vias tented up to drill 0mil, thermal gap 10mil

### Footprints (pad centres in the part's own frame; a part is rotated, then mirrored left to right if it is on the bottom)
1X01 = drill 1.016 pad 1.88: 1 0,0
SAMTEC_IPL1-107-01-X-D-K = drill 1.02 square: 01 -7.62,1.27 | drill 1.02: 02 -5.08,1.27; 03 -2.54,1.27; 04 0,1.27; 05 2.54,1.27; 06 5.08,1.27; 07 7.62,1.27; 08 -7.62,-1.27; 09 -5.08,-1.27; 10 -2.54,-1.27; 11 0,-1.27; 12 2.54,-1.27; 13 5.08,-1.27; 14 7.62,-1.27
MPPT-10-01-01-L-RA-SD = drill 1.04 pad 1.8: 1@1 -23.44,-1.55; 1@2 -21.56,-1.55; 1@3 -23.44,0.99; 1@4 -21.56,0.99; 1@5 -23.44,3.53; 1@6 -21.56,3.53; 2@1 -18.44,-1.55; 2@2 -16.56,-1.55; 2@3 -18.44,0.99; 2@4 -16.56,0.99; 2@5 -18.44,3.53; 2@6 -16.56,3.53; 3@1 -13.44,-1.55; 3@2 -11.56,-1.55; 3@3 -13.44,0.99; 3@4 -11.56,0.99; 3@5 -13.44,3.53; 3@6 -11.56,3.53; 4@1 -8.44,-1.55; 4@2 -6.56,-1.55; 4@3 -8.44,0.99; 4@4 -6.56,0.99; 4@5 -8.44,3.53; 4@6 -6.56,3.53; 5@1 -3.44,-1.55; 5@2 -1.56,-1.55; 5@3 -3.44,0.99; 5@4 -1.56,0.99; 5@5 -3.44,3.53; 5@6 -1.56,3.53; 6@1 1.56,-1.55; 6@2 3.44,-1.55; 6@3 1.56,0.99; 6@4 3.44,0.99; 6@5 1.56,3.53; 6@6 3.44,3.53; 7@1 6.56,-1.55; 7@2 8.44,-1.55; 7@3 6.56,0.99; 7@4 8.44,0.99; 7@5 6.56,3.53; 7@6 8.44,3.53; 8@1 11.56,-1.55; 8@2 13.44,-1.55; 8@3 11.56,0.99; 8@4 13.44,0.99; 8@5 11.56,3.53; 8@6 13.44,3.53; 9@1 16.56,-1.55; 9@2 18.44,-1.55; 9@3 16.56,0.99; 9@4 18.44,0.99; 9@5 16.56,3.53; 9@6 18.44,3.53; 10@1 21.56,-1.55; 10@2 23.44,-1.55; 10@3 21.56,0.99; 10@4 23.44,0.99; 10@5 21.56,3.53; 10@6 23.44,3.53 | hole 3.6: 28.5,1.12; -28.5,1.12
CAP_MZR_JA0_NIP-M = smd 4.053 x 1.592: 1 -4.274,0; 2 4.274,0
0603 = smd 1.1 x 1: 1 -0.85,0; 2 0.85,0
CAP_PC_10X12P7_NCH-M = smd 4.002 x 1.592: 1 -4.3,0; 2 4.3,0
DIODE_DO-214AA_4P38X3P62_MCC-M = smd 1.803 x 2.108: 1 -2.451,0; 2 2.451,0
SOD-323 = smd 0.63 x 0.83: A 1.15,0; C -1.15,0
LED-0603 = smd 1 x 1: A -0.877,0; C 0.877,0
6-32-HOLE = hole 3.81: 0,0
SAMTEC_IPL1-104-01-X-S-K = drill 1.02 square: 01 -3.81,0 | drill 1.02: 02 -1.27,0; 03 1.27,0; 04 3.81,0
IND_23XX-V_53_53 = drill 1.6 pad 2.108 square: 1 0,0 | drill 1.6 pad 2.108: 2 13.462,0
TRANS_R5009FNJ_ROM = smd 1.041 x 2.199: 1 2.54,-7.861; 3 -2.54,-7.861 | smd 10.16 x 7.95: 2 0,2.146
CON3_P5MM_VER_TERM-BLK_TYC = drill 1.524 pad 2.032: 1 0,0; 2 5.08,0; 3 10.16,0
MULTIWATT15_V_STM = drill 1.27 pad 1.778 square: 1 0,0 | drill 1.27 pad 1.778: 2 1.27,5.08; 3 2.54,0; 4 3.81,5.08; 5 5.08,0; 6 6.35,5.08; 7 7.62,0; 8 8.89,5.08; 9 10.16,0; 10 11.43,5.08; 11 12.7,0; 12 13.97,5.08; 13 15.24,0; 14 16.51,5.08; 15 17.78,0 | drill 1.27: 16 8.89,19.812
TO-220AB_STM = drill 1.143 pad 1.651 square: 1 0,0 | drill 1.143 pad 1.651: 2 2.54,0; 3 5.08,0
TSW-105-05-G-S(D-C) = drill 1.016: 1 -3.81,20.32; 2 -1.27,20.32; 3 1.27,20.32; 4 3.81,20.32; 5 -6.35,-20.32; 6 -3.81,-20.32; 7 -1.27,-20.32; 8 1.27,-20.32; 9 3.81,-20.32; 10 6.35,-20.32
BMR480_CONNECTOR = drill 1.6 pad 2: PIN1 4.06,26.52; PIN2 4.06,18.9; PIN3 4.06,11.28; PIN4 54.86,7.47; PIN5 54.86,11.28; PIN7 54.86,26.52; PIN8 54.86,30.33
D2PAK = smd 3.4 x 1: 1 -6.552,2.54; 2 -6.552,-2.54 | smd 12.14 x 6.8: 3 4.818,0

### Placement (x,y rotation side)
3.3V_GND  150.06,30.43 0 top
5V_GND  150.09,23.16 0 top
7.4V_GND  10.92,2.13 0 top
12V_GND_TEST  150.16,37.29 0 top
48V_GND_TEST  83.29,74.07 0 top
48V_TEST  78.18,74.12 0 top
+3.3V_TEST  150.04,26.34 0 top
+5V_TEST  150.09,19.58 0 top
+7.4V_SERVO_TEST  28.65,2.62 0 top
+7.4VOUT1_TEST  2.18,32.79 90 top
+7.4VOUT2_TEST  44.6,74.14 0 top
+12V_TEST  150.04,33.73 0 top
BACKPLANE_CONN  120.78,6.71 180 top
BACKPLANE_POWER  76.78,3.71 0 top
C1  0.330mF  [CAP_MZR_JA0_NIP-M]  24.74,22.66 0 bottom
C2  0.330mF  [CAP_MZR_JA0_NIP-M]  24.74,46.96 0 bottom
C3  0.330mF  [CAP_MZR_JA0_NIP-M]  24.71,34.85 0 bottom
C22  69.62,44.83 90 top
C23  67.44,41.53 270 top
C24  71.86,41.48 270 top
C25  74.12,44.83 270 top
C26  80.01,44.78 270 top
C27  82.6,41.48 270 top
C28  58.9,21.18 0 top
C29  49.48,14.45 0 top
C30  42.06,21.69 180 top
C31  65.25,51.69 270 top
C32  78.46,51.49 90 top
C33  74.12,51.46 90 top
C34  71.81,48.16 90 top
C35  69.67,51.66 90 top
C36  67.51,48.39 90 top
C37  58.55,53.82 0 top
C38  24.76,48.67 180 top
C39  28.4,40.46 0 top
CR1  Zener  [DIODE_DO-214AA_4P38X3P62_MCC-M]  99.47,47.5 90 top
D1  29.03,62.03 180 bottom
D2  35.46,21.08 180 top
D3  25.81,15.24 180 top
D8  40.84,44.73 180 top
D10  142.27,8.86 270 top
D11  139.4,8.86 270 top
D13  99.19,26.54 270 top
H1  133.25,72.39 0 bottom
H2  148.49,3.81 0 bottom
H3  3.71,3.81 0 bottom
H4  6.25,69.85 0 bottom
J1  19.68,3.84 180 top
L1  36.98,24.64 90 top
L2  34.95,57.91 90 bottom
R1  26.14,62.99 90 bottom
R2  36.47,7.37 180 top
R3  45.36,44.7 180 top
R4  142.14,12.7 270 top
R5  36.47,18.03 90 top
R6  30.12,15.24 180 top
R7  99.21,30.23 270 top
R8  139.34,12.7 270 top
R23  76.3,41.58 90 top
R24  57.48,40.28 0 top
R25  58.85,25.76 180 top
R26  54.99,25.73 0 top
R27  76.3,48.08 270 top
R28  58.24,72.72 0 top
R29  58.5,58.37 180 top
R30  55.17,56.21 0 top
TETHER_48V  9.4,18.64 90 top
TETHER_GND  9.47,47.57 270 top
U5  62.36,37.49 270 top
U6  58.22,30.4 90 top
U7  62.66,72.82 270 top
U8  57.99,62.64 90 top
U$1  143.54,36.83 0 top
U$2  44.48,67.64 180 bottom
U$3  TRANS_IRF1018EPBF  [D2PAK]  13.87,59.69 0 bottom

### Tracks (layer width: path | path; a pad name or v marks a point on that pad's centre or on a via)
12V_GND
  pour Top (isolate 0.762, no thermals): 76.86,0 152.04,0 152.04,58.42 151.79,58.67 140.36,58.67 123.34,75.69 97.18,75.69 97.18,31.24 76.86,10.92 76.61,10.92 76.61,0.25
48V_GND  (via drill 2.54, 2.54 pad 0.8, 5.08)  (2 unrouted)
  Bottom 1.27: v29.11,57.4 30.18,58.48 D1.A
  Bottom 1.524: C2.2 16.43,46.97 | C3.2 16.21,34.85 | C1.2 16.21,22.66 | v61.37,47.24 83.72,47.24 v84.23,47.75
  Bottom 2.54: 16.43,46.97 v16.41,46.99 | 16.21,34.85 v16.15,34.8 | 16.21,22.66 v16.15,22.61 | U$3.2 28.85,57.15 v29.11,57.4
  Bottom 5.08: v29.11,57.4 37.74,48.77 v39.01,48.77
  pour Top (isolate 0.762, no thermals): 95.91,75.95 12.34,75.95 7.26,70.87 7.26,0.51 18.69,0.51 18.69,9.91 19.46,10.67 74.32,10.67 95.91,32.26
+3.3V
  Top 0.762: U$1.6 139.34,16.13 R8.1
  Bottom 0.762: U$1.6 149.56,26.34 +3.3V_TEST.1
  Bottom 1.524: U$1.6 U$1.5 134.65,16.51 131.98,13.84 131.98,3.05 130.96,2.03 122.83,2.03 120.78,4.09 BACKPLANE_CONN.04
+5V
  Top 0.762: U$1.7 142.27,13.68 R4.1
  Top 1.524: BACKPLANE_CONN.03 BACKPLANE_CONN.02 BACKPLANE_CONN.01 143,5.44 144.81,7.24 U$1.8 U$1.7
  Bottom 0.762: U$1.8 147.88,19.58 +5V_TEST.1
+7.4V_SERVO
  pour Top (isolate 0.508, no thermals): 42.32,9.65 19.96,9.65 19.71,9.4 19.71,0.76 41.81,0.76 42.06,1.02 42.32,1.27
+12V
  Top 0.762: R7.1 99.34,31.2 U$2.PIN8
  Top 1.524: U$2.PIN7 99.47,41.25 CR1.1
  pour Bottom (isolate 0.508, no thermals): 48.16,0.25 152.04,0.25 152.04,58.17 150.01,60.2 138.07,60.2 122.58,75.69 99.21,75.69 97.43,73.91 97.43,24.38 65.18,24.38 48.16,7.37
+48V
  Top 0.762: R3.1 46.16,44.65 46.16,43.49 U$2.PIN1
  Bottom 1.27: R1.2 33.01,63.84 33.17,64.01
  pour Bottom (isolate 0.508, no thermals): 1.93,32.26 1.93,8.38 47.14,8.38 64.92,26.16 95.4,26.16 95.4,75.69 31.65,75.69 31.65,50.04 25.04,50.04 25.04,20.57 14.38,20.57 14.38,32.26
BOOT2
  Top 0.762: U7.6 65.25,63.98 C31.1
BOOT_1
  Top 0.762: U5.6 69.62,33.33 C22.1
C_OSC1
  Top 0.762: U5.2 C23.2
C_OSC2
  Top 0.762: U7.2 78.46,60.83 C32.2
FCOMP1
  Top 0.762: U5.10 71.86,30.48 C24.2 72.78,40.63 74.12,41.96 C25.2
FCOMP2
  Top 0.762: U7.10 74.12,55.02 C33.2 72.53,52.31 71.78,51.56 71.78,49.03 C34.2
GND_RAW
  pour Bottom (isolate 0.508, no thermals): 1.17,63.75 1.17,34.29 15.9,34.29 15.9,63.75
N$4
  Top 0.762: R3.2 41.75,44.7 D8.A
N$9
  Top 0.762: R4.2 142.14,9.87 D10.A
N$10
  Top 0.762: R8.2 139.34,9.79 D11.A
N$11
  Top 0.762: R6.2 D3.A
N$12
  Top 0.762: R5.2 36.34,19.02 D2.A
N$13
  Top 0.762: D13.A 99.21,27.45 R7.2
N$14
  Top 0.762: C25.1 75.12,45.68 76.3,44.5 R23.2
N$15
  Top 0.762: C34.1 71.88,47.23 R27.2
OUT1
  Top 0.762: C22.2 67.42,45.68 64.41,42.67 64.41,30.99 63.3,29.87 U5.7 | U5.7 61.87,29.87 | U5.7 60.17,27.69 58.57,27.69 58,27.11 R25.2
  Top 1.524: L1.2 42.14,32.94 U6.2 58.8,32.94 61.87,29.87
OUT2  (via drill 0.76)
  Top 0.762: v55.78,58.42 55.83,58.37 R29.2 57.65,59.53 60.1,61.98 60.1,62.64 62.64,65.18 | v63.4,50.8 65.21,50.8 C31.2
  Top 1.524: L2.2 41.15,65.18 U8.2 62.64,65.18 U7.7
  Bottom 0.762: v55.78,58.42 v63.4,50.8
R_OSC1
  Top 0.762: U5.1 59.56,40.28 R24.2
R_OSC2
  Top 0.762: U7.1 62.56,72.72 R28.2
REV_GATE
  Bottom 0.762: 26.05,62.23 R1.1
  Bottom 1.016: 27.77,62.14 D1.C
  Bottom 1.27: U$3.1 26.05,62.23 | R1.1 27.77,62.14
SS1
  Top 0.762: U5.12 80.01,36.09 C26.2
SS2
  Top 0.762: U7.12 69.67,56.92 C35.2
V_REF_CAP1
  Top 0.762: U5.14 82.6,36.14 C27.2
V_REF_CAP2
  Top 0.762: U7.14 67.51,56.08 C36.2
VOUT1  (via drill 0.76)
  Top 0.762: v16.92,28.7 12.83,32.79 +7.4VOUT1_TEST.1 | L1.1 40.54,24.64 41.3,23.88 41.3,21.78 C30.2 | R2.3 37.25,15.23 36.47,16 R5.1
  Top 1.524: L1.1 39.01,22.61 R2.3 41.31,15.23 42.09,14.45 C29.1
  Bottom 0.762: L1.1 32.92,28.7 v16.92,28.7
VOUT2  (via drill 0.76)
  Top 0.762: L2.1 34.95,64.77 v36.98,66.8 | v39.52,69.34 44.32,74.14 +7.4VOUT2_TEST.1 | C39.2 30.81,40.46 30.89,40.39 | R2.1 33.92,15.24 R6.1
  Top 1.524: L2.1 33.43,56.39 33.43,52.83 30.89,50.29 30.89,48.51 | R2.1 33.93,17.02 30.89,20.07 30.89,40.39 30.89,48.51 | C38.1 30.73,48.67 30.89,48.51
  Bottom 0.762: v36.98,66.8 v39.52,69.34
VREF1
  Top 0.762: R25.1 61.39,25.76 U5.11 61.19,23.62 56.54,23.62 55.78,24.38 55.78,25.67 R26.2
VREF2
  Top 0.762: U7.11 60.02,60.12 59.33,59.44 59.33,58.38 R29.1 59.35,57.42 58.14,56.21 R30.2
VSTART1
  Top 0.762: U5.15 60.88,21.18 C28.2
VSTART2
  Top 0.762: U7.15 61.44,53.82 C37.2
(copper drawn outside any net)
  shapes: Bottom area x1

### Text on the board
tNames: X15 Brickstribution / Ayman Motoda / Minh Nguyen / Bryce Sasser / Rachel Livesay / Katherine Sandys | - | - | + | 48V LED | + | 12V LED | 7.4V LED #2 | + | - | 7.4V LED #1 | 3.3V LED | 5V LED
bNames: + | - | + | - | + | -